# EAGLE design uHS (EAGLE 5.10)
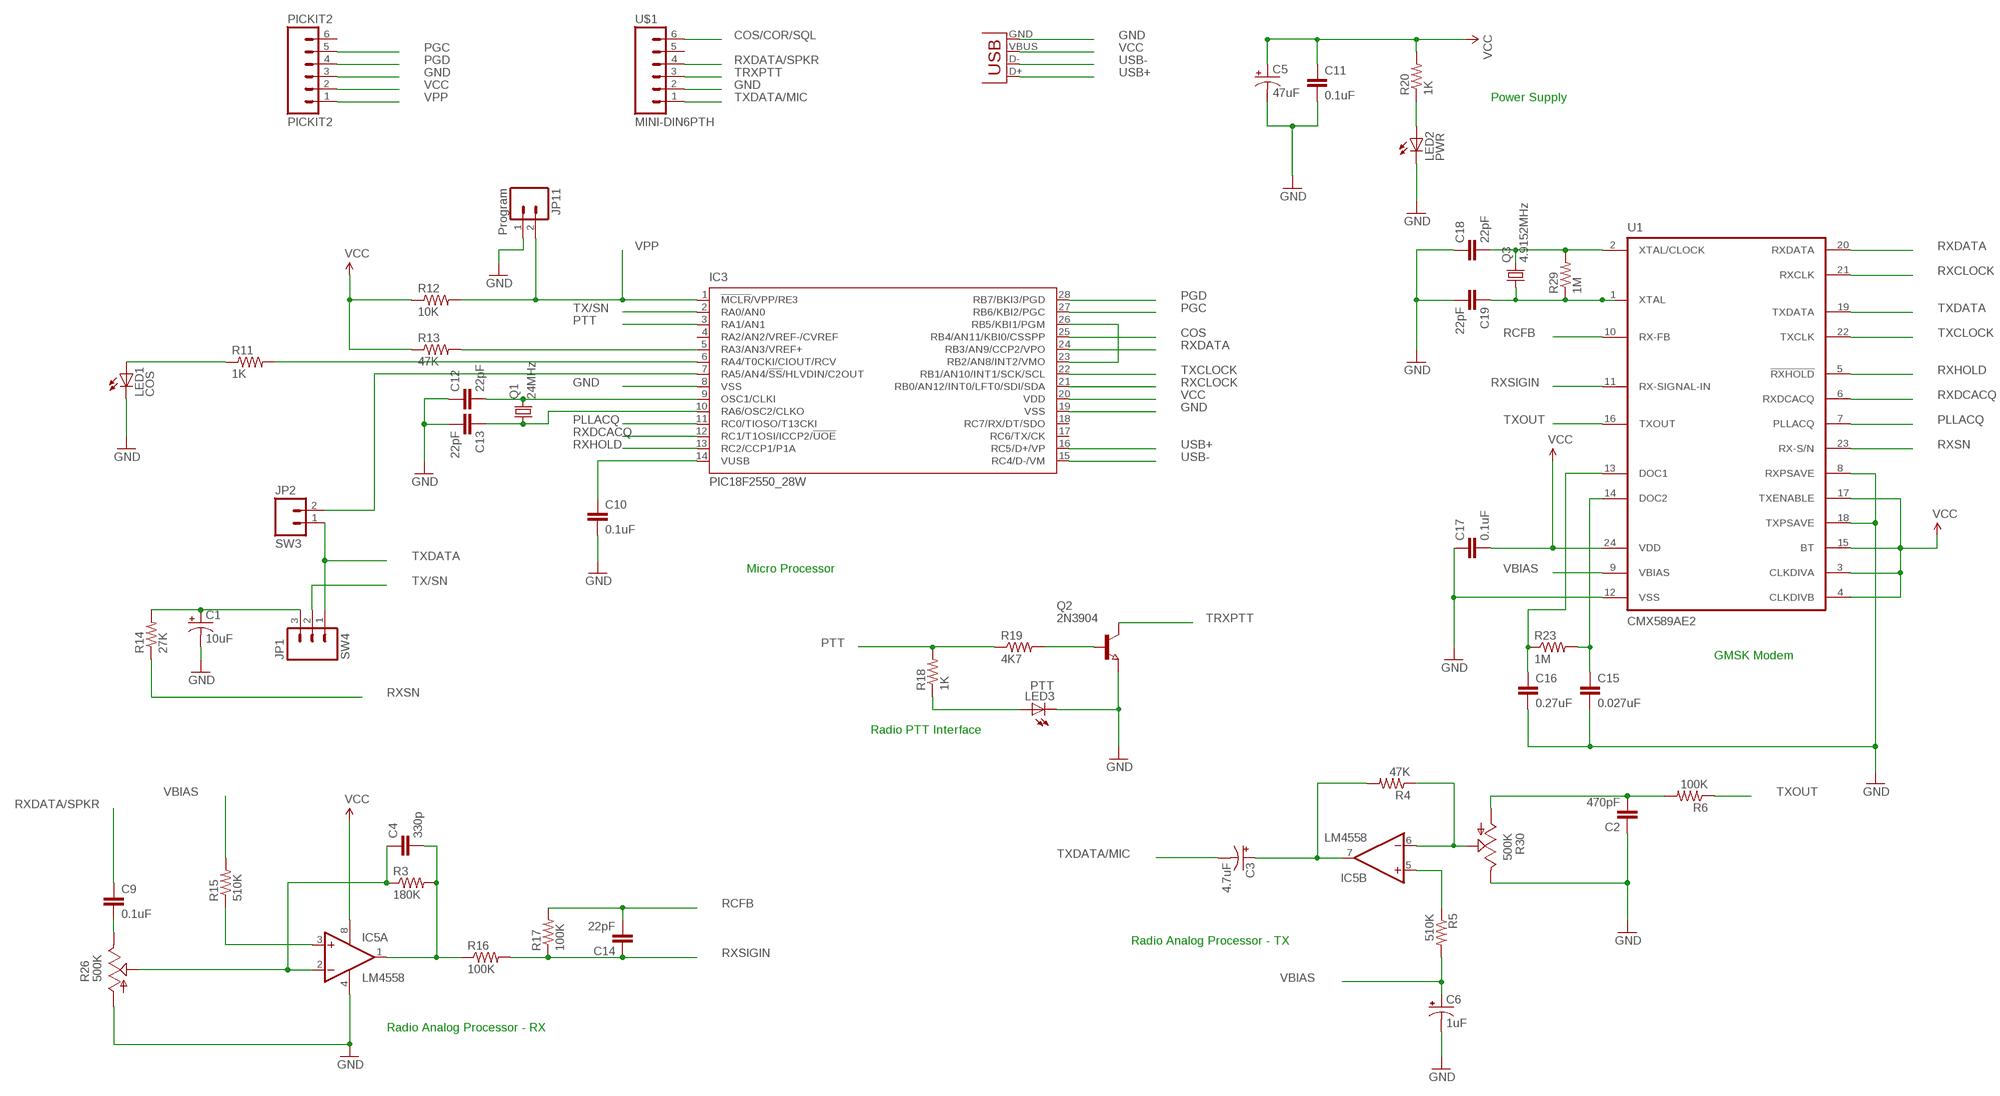
[diagram p0: schematic, sheet 1]

## Parts
C1  10uF  CAP_POLPTH2  [CPOL-RADIAL-10UF-25V]
C2  470pF  C-EUC0805  [C0805]
C3  4.7uF  CAP_POLPTH2  [CPOL-RADIAL-10UF-25V]
C4  330p  C-EUC0805  [C0805]
C5  47uF  CAP_POLPTH2  [CPOL-RADIAL-10UF-25V]
C6  1uF  CAP_POLPTH2  [CPOL-RADIAL-10UF-25V]
C9  0.1uF  C-EUC0805  [C0805]
C10  0.1uF  C-EUC0805  [C0805]
C11  0.1uF  C-EUC0805  [C0805]
C12  22pF  C-EUC0805  [C0805]
C13  22pF  C-EUC0805  [C0805]
C14  22pF  C-EUC0805  [C0805]
C15  0.027uF  C-EUC0805  [C0805]
C16  0.27uF  C-EUC0805  [C0805]
C17  0.1uF  C-EUC0805  [C0805]
C18  22pF  C-EUC0805  [C0805]
C19  22pF  C-EUC0805  [C0805]
IC3  PIC18F2550_28W  [SO28W]
IC5  LM4558  OPA2344U  [SO08]
J1  USBSMD  [USB-MINIB]
JP1  SW4  M03PTH  [1X03]
JP2  SW3  M02PTH  [1X02]
JP11  Program  M02PTH  [1X02]
LED1  COS  LEDCHIPLED_1206  [CHIPLED_1206]
LED2  PWR  LEDCHIPLED_1206  [CHIPLED_1206]
LED3  PTT  LEDCHIPLED_1206  [CHIPLED_1206]
PICKIT2  PICKIT2  M06SIP  [1X06]
Q1  24MHz  CRYSTALHC49US  [HC49US]
Q2  2N3904  NPN-TRANSISTOR_SOT23  [SOT23]
Q3  4.9152MHz  CRYSTALHC49US  [HC49US]
R3  180K  R-US_M0805  [M0805]
R4  47K  R-US_M0805  [M0805]
R5  510K  R-US_M0805  [M0805]
R6  100K  R-US_M0805  [M0805]
R11  1K  R-US_M0805  [M0805]
R12  10K  R-US_M0805  [M0805]
R13  47K  R-US_M0805  [M0805]
R14  27K  R-US_M0805  [M0805]
R15  510K  R-US_M0805  [M0805]
R16  100K  R-US_M0805  [M0805]
R17  100K  R-US_M0805  [M0805]
R18  1K  R-US_M0805  [M0805]
R19  4K7  R-US_M0805  [M0805]
R20  1K  R-US_M0805  [M0805]
R23  1M  R-US_M0805  [M0805]
R26  500K  TRIM_US-CA6V  [CA6V]
R29  1M  R-US_M0805  [M0805]
R30  500K  TRIM_US-CA6V  [CA6V]
U1  CMX589AE2  [TSSOP24]
U$1  MINI-DIN6PTH  [MINI-DIN6]

## Nets
COS: IC3.25(RB4/AN11/KBI0/CSSPP)
COS/COR/SQL: U$1.6
GND: C1.2(-) C2.1 C5.2(-) C6.2(-) C10.2 C11.2 C12.1 C13.2 C15.2 C16.2 C17.1 C18.1 C19.2 IC3.8(VSS) IC3.19(VSS) IC5.4(A:V-) J1.GND JP11.1 LED1.C LED2.C LED3.C PICKIT2.3 Q2.2(E) R26.A R30.E U1.8(RXPSAVE) U1.12(VSS) U1.18(TXPSAVE) U$1.2
N$1: IC5.6(B:-IN) R4.1 R30.S
N$3: IC3.23(RB2/AN8/INT2/VMO) IC3.26(RB5/KBI1/PGM)
N$4: IC3.5(RA3/AN3/VREF+) R13.2
N$5: IC3.6(RA4/T0CKI/CIOUT/RCV) R11.2
N$6: LED1.A R11.1
N$7: IC3.7(RA5/AN4/!SS!/HLVDIN/C2OUT) JP2.2
N$8: C1.1(+) JP1.3 R14.2
N$9: C12.2 IC3.9(OSC1/CLKI) Q1.2
N$10: C13.1 IC3.10(RA6/OSC2/CLKO) Q1.1
N$11: C10.1 IC3.14(VUSB)
N$13: LED2.A R20.1
N$14: Q2.1(B) R19.2
N$15: C4.2 IC5.1(A:OUT) R3.2 R16.1
N$16: LED3.A R18.1
N$17: IC5.3(A:+IN) R15.1
N$18: C4.1 IC5.2(A:-IN) R3.1 R26.S
N$20: C9.2 R26.E
N$21: C2.2 R6.2 R30.A
N$22: C3.1(+) IC5.7(B:OUT) R4.2
N$24: IC5.5(B:+IN) R5.1
N$38: C18.2 Q3.2 R29.2 U1.2(XTAL/CLOCK)
N$42: C16.1 R23.1 U1.13(DOC1)
N$43: C15.1 R23.2 U1.14(DOC2)
N$59: C19.1 Q3.1 R29.1 U1.1(XTAL)
PGC: IC3.27(RB6/KBI2/PGC) PICKIT2.5
PGD: IC3.28(RB7/BKI3/PGD) PICKIT2.4
PLLACQ: IC3.11(RC0/TIOSO/T13CKI) U1.7(PLLACQ)
PTT: IC3.3(RA1/AN1) R18.2 R19.1
RCFB: C14.2 R17.2 U1.10(RX-FB)
RXCLOCK: IC3.21(RB0/AN12/INT0/LFT0/SDI/SDA) U1.21(RXCLK)
RXDATA: IC3.24(RB3/AN9/CCP2/VPO) U1.20(RXDATA)
RXDATA/SPKR: C9.1 U$1.4
RXDCACQ: IC3.12(RC1/T1OSI/ICCP2/!UOE) U1.6(RXDCACQ)
RXHOLD: IC3.13(RC2/CCP1/P1A) U1.5(!RXHOLD!)
RXSIGIN: C14.1 R16.2 R17.1 U1.11(RX-SIGNAL-IN)
RXSN: R14.1 U1.23(RX-S/N)
TRXPTT: Q2.3(C) U$1.3
TX/SN: IC3.2(RA0/AN0) JP1.2
TXCLOCK: IC3.22(RB1/AN10/INT1/SCK/SCL) U1.22(TXCLK)
TXDATA: JP1.1 JP2.1 U1.19(TXDATA)
TXDATA/MIC: C3.2(-) U$1.1
TXOUT: R6.1 U1.16(TXOUT)
USB+: IC3.16(RC5/D+/VP) J1.D+
USB-: IC3.15(RC4/D-/VM) J1.D-
VBIAS: C6.1(+) R5.2 R15.2 U1.9(VBIAS)
VCC: C5.1(+) C11.1 C17.2 IC3.20(VDD) IC5.8(A:V+) J1.VBUS PICKIT2.2 R12.1 R13.1 R20.2 U1.3(CLKDIVA) U1.4(CLKDIVB) U1.15(BT) U1.17(TXENABLE) U1.24(VDD)
VPP: IC3.1(!MCLR!/VPP/RE3) JP11.2 PICKIT2.1 R12.2
Unconnected: IC3.4(RA2/AN2/VREF-/CVREF) IC3.17(RC6/TX/CK) IC3.18(RC7/RX/DT/SDO) PICKIT2.6 U$1.5

## Notes on the sheet
- Power Supply
- Micro Processor
- GMSK Modem
- Radio PTT Interface
- Radio Analog Processor - TX
- Radio Analog Processor - RX

## Library data of the parts
C1 C3 C5 C6 = SparkFun:CAP_POL: Capacitor Polarized These are standard SMD and PTH capacitors. Normally 10uF, 47uF, and 100uF in electrolytic and tantalum varieties. Always verify the external diameter of the through hole cap, it varies with capacity, voltage, and manufacturer. The EIA devices should be standard.
C2 C4 C9-C19 = resistor:C-EU: CAPACITOR, European symbol
IC3 = microchip:PIC18F2*_28: USB Microcontrollers with nanoWatt Technology High-Performance, Enhanced Flash, 28/40/44-Pin, Source: http://ww1.microchip.com/downloads/en/devicedoc/39632c.pdf
IC5 = linear:OPA2*: Dual Operational Amplifier Low Power, Single-Supply, Rail-To-Rail Operational Amplifier Source: http://focus.ti.com/lit/ds/symlink/opa2345.pdf http://focus.ti.com .. opa241.pdf http://focus.ti.com/lit/ds/symlink/opa2134.pdf
J1 = SparkFun:USB: USB Connectors USB-B-PTH is fully proven SKU : PRT-00139 USB-miniB is fully proven SKU : PRT-00587 USB-A-PCB is untested. USB-A-H is throughly reviewed, but untested. Spark Fun Electronics SKU : PRT-00437 USB-B-SMT is throughly reviewed, but untested. Needs silkscreen touching up. USB-A-S has not been used/tested USB-MB-H has not been used/tested
JP1 = SparkFun:M03: Header 3 Standard 3-pin 0.1" header. Use with straight break away headers (SKU : PRT-00116), right angle break away headers (PRT-00553), swiss pins (PRT-00743), machine pins (PRT-00117), and female headers (PRT-00115). Molex polarized connector foot print use with SKU : PRT-08232 with associated crimp pins and housings.
JP2 JP11 = SparkFun:M02: Header 2 Standard 2-pin 0.1" header. Use with straight break away headers (SKU : PRT-00116), right angle break away headers (PRT-00553), swiss pins (PRT-00743), machine pins (PRT-00117), and female headers (PRT-00115). Molex polarized connector foot print use with SKU : PRT-08233 with associated crimp pins and housings.
LED1-LED3 = led:LED: LED OSRAM: - CHIPLED LG R971, LG N971, LY N971, LG Q971, LY Q971, LO R971, LY R971 LH N974, LH R974 LS Q976, LO Q976, LY Q976 LO Q996 - Hyper CHIPLED LW Q18S LB Q993, LB Q99A, LB R99A - SideLED LS A670, LO A670, LY A670, LG A670, LP A670 LB A673, LV A673, LT A673, LW A673 LH A674 LY A675 LS A676, LA A676, LO A676, LY A676, LW A676 LS A679, LY A679, LG A679 - Hyper Micro SIDELED® LS Y876, LA Y876, LO Y876, LY Y876 LT Y87S - SmartLED LW L88C, LW L88S LB L89C, LB L89S, LG L890 LS L89K, LO L89K, LY L89K LS L896, LA L896, LO L896, LY L896 - TOPLED LS T670, LO T670, LY T670, LG T670, LP T670 LSG T670, LSP T670, LSY T670, LOP T670, LYG T670 LG T671, LOG T671, LSG T671 LB T673, LV T673, LT T673, LW T673 LH T674 LS T676, LA T676, LO T676, LY T676, LB T676, LH T676, LSB T676, LW T676 LB T67C, LV T67C, LT T67C, LS T67K, LO T67K, LY T67K, LW E67C LS E67B, LA E67B, LO E67B, LY E67B, LB E67C, LV E67C, LT E67C LW T67C LS T679, LY T679, LG T679 LS T770, LO T770, LY T770, LG T770, LP T770 LB T773, LV T773, LT T773, LW T773 LH T774 LS E675, LA E675, LY E675, LS T675 LS T776, LA T776, LO T776, LY T776, LB T776 LHGB T686 LT T68C, LB T68C - Hyper Mini TOPLED® LB M676 - Mini TOPLED Santana® LG M470 LS M47K, LO M47K, LY M47K Source: http://www.osram.convergy.de LUXEON: - LUMILED® LXK2-PW12-R00, LXK2-PW12-S00, LXK2-PW14-U00, LXK2-PW14-V00 LXK2-PM12-R00, LXK2-PM12-S00, LXK2-PM14-U00 LXK2-PE12-Q00, LXK2-PE12-R00, LXK2-PE12-S00, LXK2-PE14-T00, LXK2-PE14-U00 LXK2-PB12-K00, LXK2-PB12-L00, LXK2-PB12-M00, LXK2-PB14-N00, LXK2-PB14-P00, LXK2-PB14-Q00 LXK2-PR12-L00, LXK2-PR12-M00, LXK2-PR14-Q00, LXK2-PR14-R00 LXK2-PD12-Q00, LXK2-PD12-R00, LXK2-PD12-S00 LXK2-PH12-R00, LXK2-PH12-S00 LXK2-PL12-P00, LXK2-PL12-Q00, LXK2-PL12-R00 Source: www.luxeon.com KINGBRIGHT: KA-3528ASYC Source: www.kingbright.com
PICKIT2 = SparkFun:M06: Header 6 Standard 6-pin 0.1" header. Use with straight break away headers (SKU : PRT-00116), right angle break away headers (PRT-00553), swiss pins (PRT-00743), machine pins (PRT-00117), and female headers (PRT-00115). Molex polarized connector foot print use with SKU : PRT-08094 with associated crimp pins and housings. NOTES ON THE VARIANTS LOCK and LOCK_LONGPADS... This footprint was designed to help hold the alignment of a through-hole component (i.e. 6-pin header) while soldering it into place. You may notice that each hole has been shifted either up or down by 0.005 of an inch from it's more standard position (which is a perfectly straight line). This slight alteration caused the pins (the squares in the middle) to touch the edges of the holes. Because they are alternating, it causes a "brace" to hold the component in place. 0.005 has proven to be the perfect amount of "off-center" position when using our standard breakaway headers. Although looks a little odd when you look at the bare footprint, once you have a header in there, the alteration is very hard to notice. Also, if you push a header all the way into place, it is covered up entirely on the bottom side. This idea of altering the position of holes to aid alignment will be further integrated into the Sparkfun Library for other footprints. It can help hold any component with 3 or more connection pins.
Q1 Q3 = SparkFun:CRYSTAL: Crystals Various standard crystals. Proven footprints. Spark Fun Electronics SKU : COM-00534
Q2 = semicon-smd-ipc:NPN-TRANSISTOR_: NPN TRANSISTOR
R3-R6 R11-R20 R23 R29 = resistor:R-US_: RESISTOR, American symbol
R26 R30 = pot:TRIM_US-: POTENTIOMETER
U1 = cml-micro:CMX589A: HIGH-SPEED GMSK MODEM
U$1 = SparkFun:MINI-DIN6: mini DIN 6 Connector Commonly found on the back of a computer for PS2 keyboard and mice. Schematic and footprint are proven. Spark Fun Electronics SKU : PRT-08509

## Board
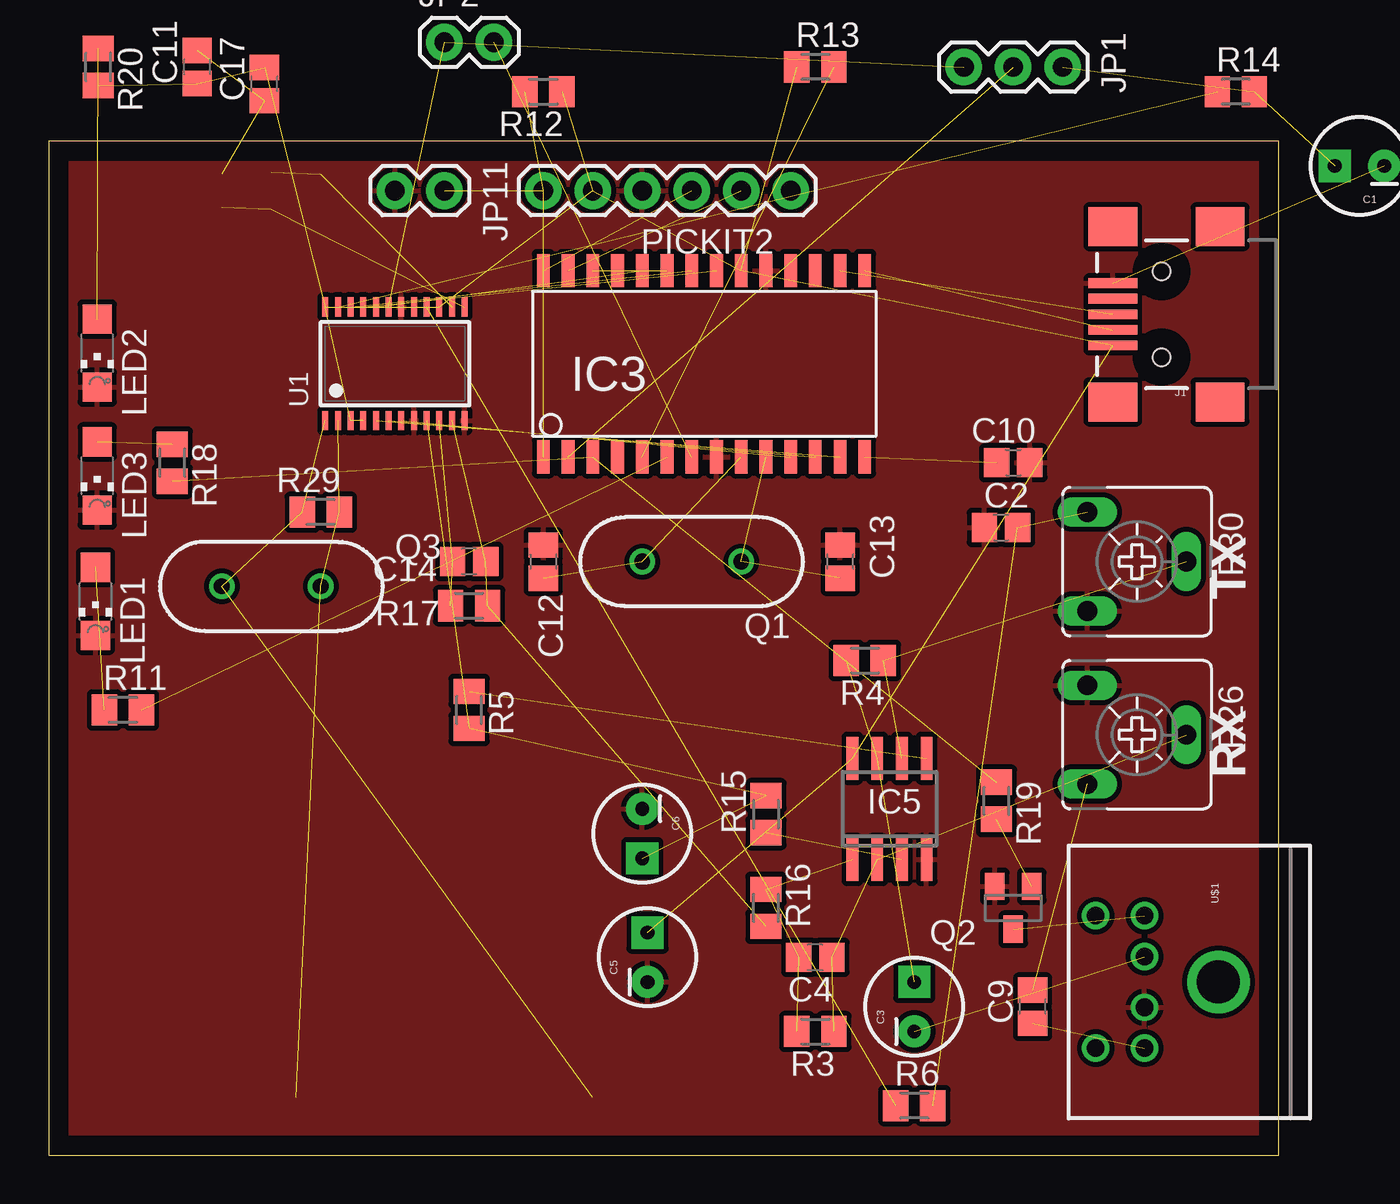
[diagram p1: board, top side]
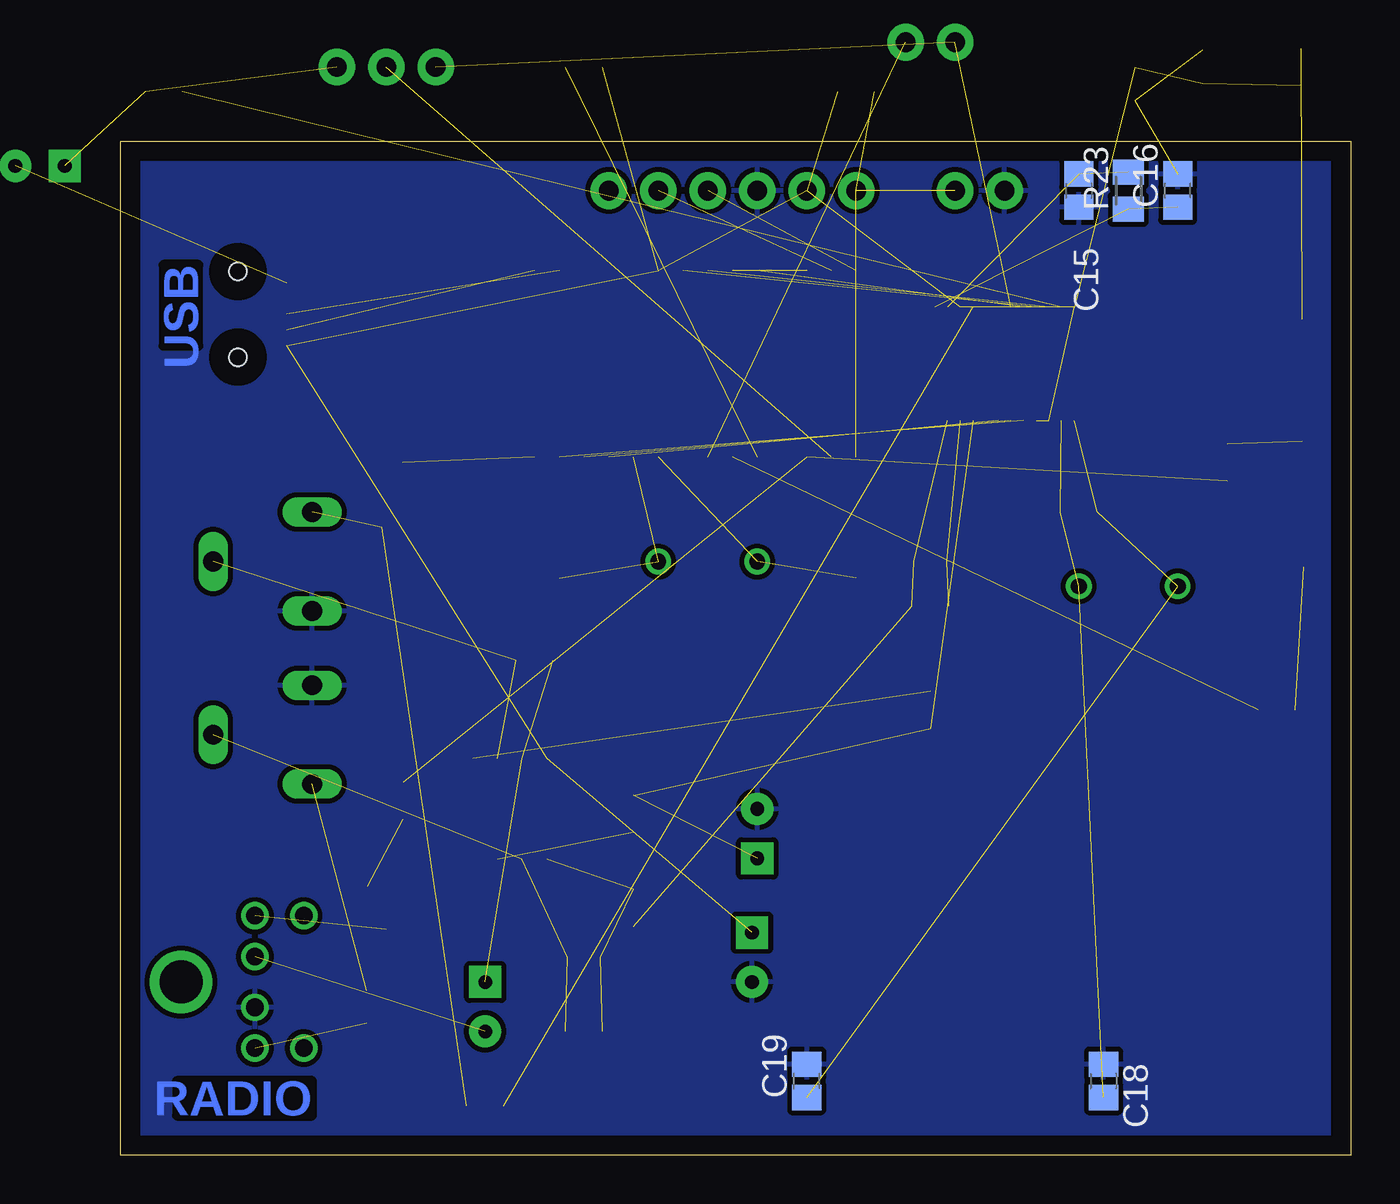
[diagram p2: board, bottom side, seen from below]

Size 63.17 x 52.06 mm. Coordinates in mm from the lower left corner, seen from the top.
Outline: 63.17,0 63.17,52.06 0,52.06 0,0 63.17,0
Copper layers (1*16): Top 0.035mm / dielectric 1.5mm / Bottom 0.035mm
Design rules "olimex-10mils": minimum track width 10mil, minimum drill 24mil, track to track 10mil, track to pad 10mil, pad to pad 10mil, via to via 10mil, smd to smd 10mil, copper to edge 40mil, drill to drill 10mil, minimum pad ring 10mil, minimum via ring 8mil, stop-mask expansion 0mil, vias tented up to drill 0mil, thermal gap 10mil

### Footprints (pad centres in the part's own frame; a part is rotated, then mirrored left to right if it is on the bottom)
CPOL-RADIAL-10UF-25V = drill 0.7 pad 1.651 square: 1 1.27,0 | drill 0.7 pad 1.651 round: 2 -1.27,0
C0805 = smd 1.3 x 1.5: 1 -0.85,0; 2 0.85,0
SO28W = smd 0.65 x 1.7: 1 -7.62,-4.78; 2 -6.35,-4.78; 3 -5.08,-4.78; 4 -3.81,-4.78; 5 -2.54,-4.78; 6 -1.27,-4.78; 7 0,-4.78; 8 1.27,-4.78; 9 2.54,-4.78; 10 3.81,-4.78; 11 5.08,-4.78; 12 6.35,-4.78; 13 7.62,-4.78; 14 8.89,-4.78; 15 8.89,4.78; 16 7.62,4.78; 17 6.35,4.78; 18 5.08,4.78; 19 3.81,4.78; 20 2.54,4.78; 21 1.27,4.78; 22 0,4.78; 23 -1.27,4.78; 24 -2.54,4.78; 25 -3.81,4.78; 26 -5.08,4.78; 27 -6.35,4.78; 28 -7.62,4.78
SO08 = smd 0.6 x 2.2: 1 -1.905,-2.6; 2 -0.635,-2.6; 3 0.635,-2.6; 4 1.905,-2.6; 5 1.905,2.6; 6 0.635,2.6; 7 -0.635,2.6; 8 -1.905,2.6
USB-MINIB = smd 2.5 x 0.5: D+ 2.5,0; D- 2.5,0.8; GND 2.5,-1.6; ID 2.5,-0.8; VBUS 2.5,1.6 | smd 2.5 x 2: GND@1 -3,-4.5; GND@2 -3,4.5; GND@3 2.5,4.5; GND@4 2.5,-4.5 | hole 0.9: 0,2.2; 0,-2.2
1X03 = drill 1.016 pad 1.88 round: 1 0,0; 2 2.54,0; 3 5.08,0
1X02 = drill 1.016 pad 1.88 round: 1 0,0; 2 2.54,0
CHIPLED_1206 = smd 1.5 x 1.5: A 0,-1.75; C 0,1.75
1X06 = drill 1.016 pad 1.88 round: 1 0,0; 2 2.54,0; 3 5.08,0; 4 7.62,0; 5 10.16,0; 6 12.7,0
HC49US = drill 0.813 round: 1 -2.54,0; 2 2.54,0
SOT23 = smd 1 x 1.4: 1 -0.95,-1.1; 2 0.95,-1.1; 3 0,1.1
M0805 = smd 1.3 x 1.6: 1 -0.95,0; 2 0.95,0
CA6V = drill 1.016 long: A -2.54,-2.54; E 2.54,-2.54; S 0,2.54
TSSOP24 = smd 0.305 x 0.991: 1 -3.575,-2.918; 2 -2.925,-2.918; 3 -2.275,-2.918; 4 -1.625,-2.918; 5 -0.975,-2.918; 6 -0.325,-2.918; 7 0.325,-2.918; 8 0.975,-2.918; 9 1.625,-2.918; 10 2.275,-2.918; 11 2.925,-2.918; 12 3.575,-2.918; 13 3.575,2.918; 14 2.925,2.918; 15 2.275,2.918; 16 1.625,2.918; 17 0.975,2.918; 18 0.325,2.918; 19 -0.325,2.918; 20 -0.975,2.918; 21 -1.625,2.918; 22 -2.275,2.918; 23 -2.925,2.918; 24 -3.575,2.918
MINI-DIN6 = drill 0.9 round: 1 -1.3,-8.5; 2 1.3,-8.5; 3 -3.4,-8.5; 4 3.4,-8.5; 5 -3.4,-11; 6 3.4,-11 | drill 2.2 round: P$1 0,-4.7

### Placement (x,y rotation side)
C1  67.31,50.8 180 top
C2  48.9,32.23 0 top
C3  44.45,7.62 90 top
C4  39.37,10.16 180 top
C5  30.75,10.16 90 top
C6  30.48,16.51 270 top
C9  50.53,7.62 90 top
C10  49.53,35.56 0 top
C11  7.62,55.88 90 top
C12  25.4,30.48 270 top
C13  40.64,30.48 90 top
C14  21.59,30.48 180 top
C15  13.97,49.53 270 bottom
C16  8.89,49.53 90 bottom
C17  11.08,55 90 top
C18  12.7,3.81 270 bottom
C19  27.94,3.81 90 bottom
IC3  33.02,40.64 0 top
IC5  43.18,17.78 0 top
J1  57.15,43.18 180 top
JP1  46.99,55.88 0 top  (outside the outline)
JP2  20.32,57.15 0 top  (outside the outline)
JP11  17.78,49.53 0 top
LED1  2.4,28.44 180 top
LED2  2.49,41.19 180 top
LED3  2.49,34.88 180 top
PICKIT2  25.4,49.53 0 top
Q1  33.02,30.48 180 top
Q2  49.53,12.7 180 top
Q3  11.43,29.21 0 top
R3  39.37,6.35 180 top
R4  41.91,25.4 180 top
R5  21.59,22.86 270 top
R6  44.45,2.54 0 top
R11  3.81,22.86 0 top
R12  25.4,54.61 180 top
R13  39.37,55.88 0 top  (outside the outline)
R14  60.96,54.61 0 top
R15  36.83,17.51 90 top
R16  36.83,12.7 270 top
R17  21.59,28.21 180 top
R18  6.35,35.56 270 top
R19  48.67,18.2 270 top
R20  2.54,55.88 270 top
R23  11.43,49.53 90 bottom
R26  55.88,21.59 270 top
R29  13.97,33.02 0 top
R30  55.88,30.48 270 top
U1  17.78,40.64 0 top
U$1  64.77,8.89 270 top

### Tracks (layer width: path | path; a pad name or v marks a point on that pad's centre or on a via)
GND  (3 unrouted)
  pour Bottom: 0,52.07 63.5,52.07 63.5,0 0,0
  pour Top: 0,52.07 63.5,52.07 63.5,0 0,0
N$1  (2 unrouted)
N$3  (1 unrouted)
N$4  (1 unrouted)
N$5  (1 unrouted)
N$6  (1 unrouted)
N$7  (1 unrouted)
N$8  (2 unrouted)
N$9  (2 unrouted)
N$10  (2 unrouted)
N$11  (1 unrouted)
N$13  (1 unrouted)
N$14  (1 unrouted)
N$15  (3 unrouted)
N$16  (1 unrouted)
N$17  (1 unrouted)
N$18  (3 unrouted)
N$20  (1 unrouted)
N$21  (2 unrouted)
N$22  (2 unrouted)
N$24  (1 unrouted)
N$38  (3 unrouted)
N$42  (2 unrouted)
N$43  (2 unrouted)
N$59  (3 unrouted)
PGC  (1 unrouted)
PGD  (1 unrouted)
PLLACQ  (1 unrouted)
PTT  (2 unrouted)
RCFB  (2 unrouted)
RXCLOCK  (1 unrouted)
RXDATA  (1 unrouted)
RXDATA/SPKR  (1 unrouted)
RXDCACQ  (1 unrouted)
RXHOLD  (1 unrouted)
RXSIGIN  (3 unrouted)
RXSN  (1 unrouted)
TRXPTT  (1 unrouted)
TX/SN  (1 unrouted)
TXCLOCK  (1 unrouted)
TXDATA  (2 unrouted)
TXDATA/MIC  (1 unrouted)
TXOUT  (1 unrouted)
USB+  (1 unrouted)
USB-  (1 unrouted)
VBIAS  (3 unrouted)
VCC  (14 unrouted)
VPP  (3 unrouted)

### Text on the board
Bottom: USB | RADIO
tPlace: TX | RX | gmskhotspot.com | NI2O 12/2010 | uHS V1.05